# Altium project Dingo_ServoBoard.PrjPcb
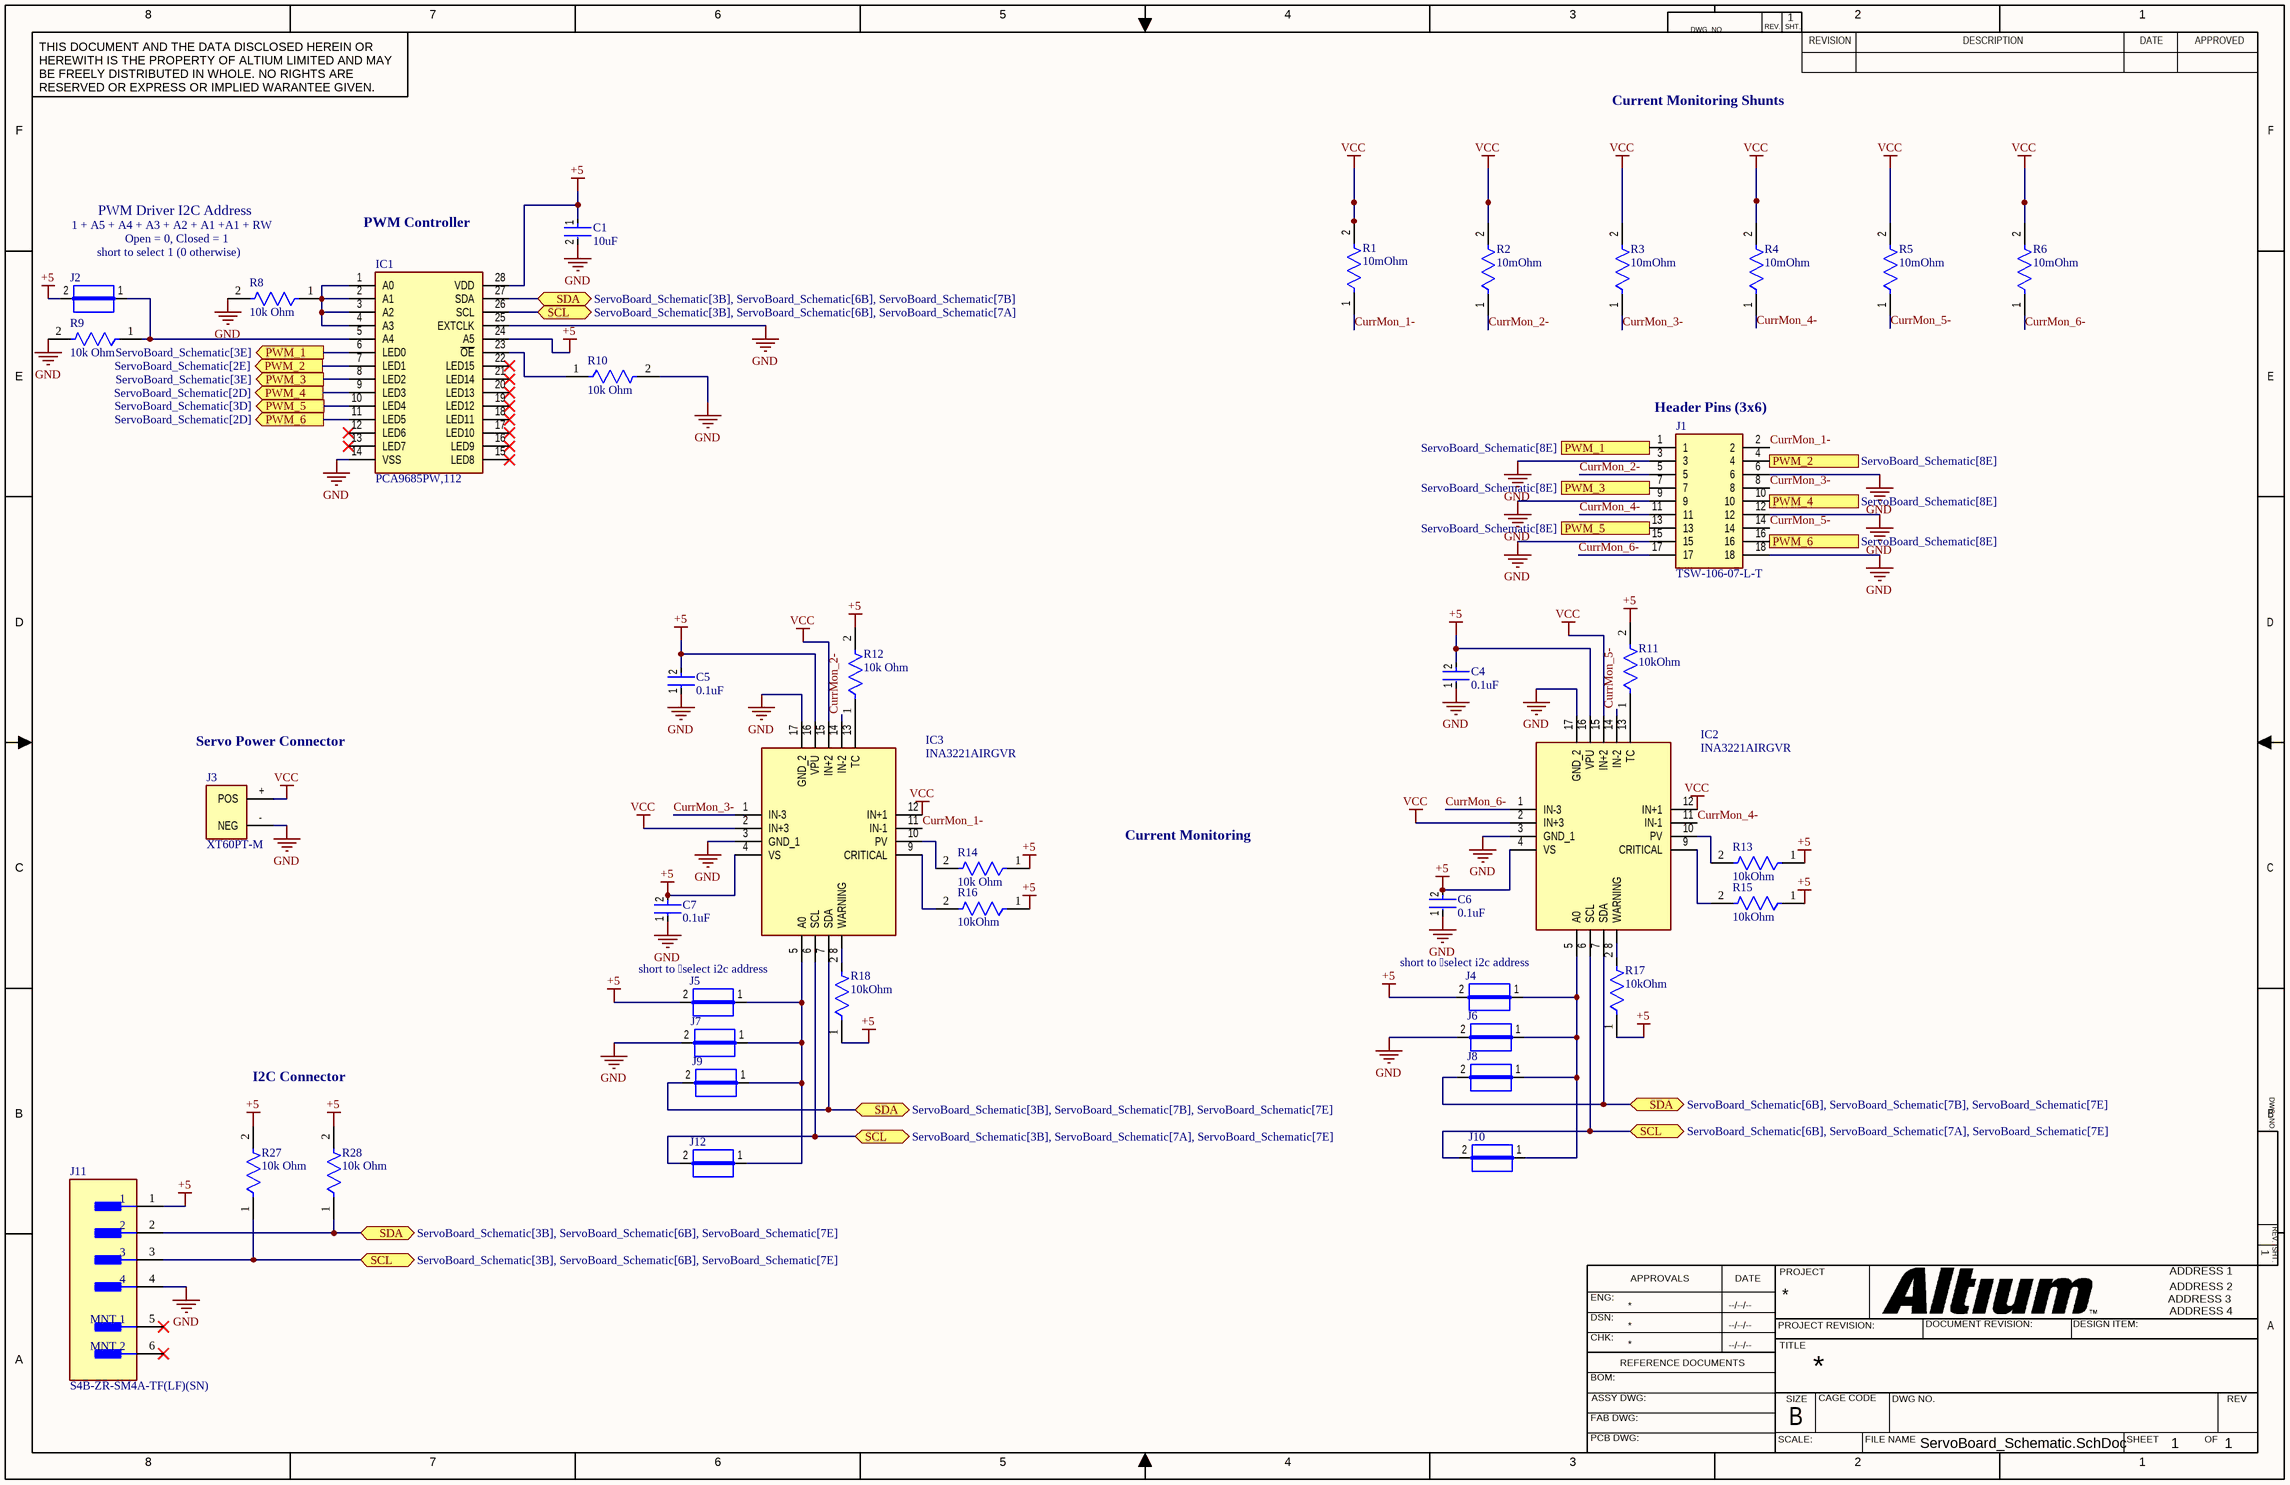
[diagram p0: ServoBoard_Schematic.SchDoc]
1 sheet, 39 parts. Net scope: flat (ports and power ports of the same name join across sheets).
Board file: ServoBoard.PcbDoc

## Sheet ServoBoard_Schematic.SchDoc
size 431 x 279 mm; Organization: ORGANIZATION; Address1: ADDRESS 1; Address2: ADDRESS 2; Address3: ADDRESS 3; Address4: ADDRESS 4; Revision: -; SheetNumber: 1; SheetTotal: 1; ENG_APP_DATE: --/--/--; DSN_APP_DATE: --/--/--; CHK_APP_DATE: --/--/--

### Parts
C1  10uF  [FP-GRM188-0_1-e0_2_0_55-IPC_A]
C4  0.1uF  [FP-GCJ188-0_2-IPC_A]
C5  0.1uF  [FP-GCJ188-0_2-IPC_A]
C6  0.1uF  [FP-GCJ188-0_2-IPC_A]
C7  0.1uF  [FP-GCJ188-0_2-IPC_A]
IC1  PCA9685PW,112  [SOP65P640X110-28N]
IC2  INA3221AIRGVR  [QFN65P400X400X100-17N-D]
IC3  INA3221AIRGVR  [QFN65P400X400X100-17N-D]
J1  TSW-106-07-L-T  [HDRV18W64P254_3X6_1524X749X838P]
J2  JUMPER  [JUMPER]  (value not drawn)
J3  XT60PT-M  [XT60PT-M]
J4  JUMPER  [JUMPER]  (value not drawn)
J5  JUMPER  [JUMPER]  (value not drawn)
J6  JUMPER  [JUMPER]  (value not drawn)
J7  JUMPER  [JUMPER]  (value not drawn)
J8  JUMPER  [JUMPER]  (value not drawn)
J9  JUMPER  [JUMPER]  (value not drawn)
J10  JUMPER  [JUMPER]  (value not drawn)
J11  S4B-ZR-SM4A-TF(LF)(SN)  [FP-S4B-ZR-SM4A-TF_LF_SN-MFG]
J12  JUMPER  [JUMPER]  (value not drawn)
R1  10mOhm  [FP-ERJ8CW-MFG]
R2  10mOhm  [FP-ERJ8CW-MFG]
R3  10mOhm  [FP-ERJ8CW-MFG]
R4  10mOhm  [FP-ERJ8CW-MFG]
R5  10mOhm  [FP-ERJ8CW-MFG]
R6  10mOhm  [FP-ERJ8CW-MFG]
R8  10k Ohm  [FP-ERA3A-IPC_C]
R9  10k Ohm  [FP-ERA3A-IPC_C]
R10  10k Ohm  [FP-ERA3A-IPC_C]
R11  10kOhm  [FP-ERA3A-IPC_C]
R12  10k Ohm  [FP-ERA3A-IPC_C]
R13  10kOhm  [FP-ERA3A-IPC_C]
R14  10k Ohm  [FP-ERA3A-IPC_C]
R15  10kOhm  [FP-ERA3A-IPC_C]
R16  10kOhm  [FP-ERA3A-IPC_C]
R17  10kOhm  [FP-ERA3A-IPC_C]
R18  10kOhm  [FP-ERA3A-IPC_C]
R27  10k Ohm  [FP-ERA3A-IPC_C]
R28  10k Ohm  [FP-ERA3A-IPC_C]

### Ports
PWM_1 (in, see ServoBoard_Schematic[8E]), PWM_1 (out, see ServoBoard_Schematic[3E]), PWM_2 (in, see ServoBoard_Schematic[8E]), PWM_2 (out, see ServoBoard_Schematic[2E]), PWM_3 (in, see ServoBoard_Schematic[8E]), PWM_3 (out, see ServoBoard_Schematic[3E]), PWM_4 (in, see ServoBoard_Schematic[8E]), PWM_4 (out, see ServoBoard_Schematic[2D]), PWM_5 (in, see ServoBoard_Schematic[8E]), PWM_5 (out, see ServoBoard_Schematic[3D]), PWM_6 (in, see ServoBoard_Schematic[8E]), PWM_6 (out, see ServoBoard_Schematic[2D]), SCL (bidir, see ServoBoard_Schematic[3B], ServoBoard_Schematic[6B], ServoBoard_Schematic[7A]), SCL (bidir, see ServoBoard_Schematic[3B], ServoBoard_Schematic[6B], ServoBoard_Schematic[7E]), SCL (bidir, see ServoBoard_Schematic[3B], ServoBoard_Schematic[7A], ServoBoard_Schematic[7E]), SCL (bidir, see ServoBoard_Schematic[6B], ServoBoard_Schematic[7A], ServoBoard_Schematic[7E]), SDA (bidir, see ServoBoard_Schematic[3B], ServoBoard_Schematic[6B], ServoBoard_Schematic[7B]), SDA (bidir, see ServoBoard_Schematic[3B], ServoBoard_Schematic[6B], ServoBoard_Schematic[7E]), SDA (bidir, see ServoBoard_Schematic[3B], ServoBoard_Schematic[7B], ServoBoard_Schematic[7E]), SDA (bidir, see ServoBoard_Schematic[6B], ServoBoard_Schematic[7B], ServoBoard_Schematic[7E])

### Nets
+5: C1.1 C4.2 C5.2 C6.2 C7.2 IC1.24(A5) IC1.28(VDD) IC2.4(VS) IC2.16(VPU) IC3.4(VS) IC3.16(VPU) J2.2 J4.2 J5.2 J11.1 R11.2 R12.2 R13.1 R14.1 R15.1 R16.1 R17.1 R18.1 R27.2 R28.2
GND: C1.2 C4.1 C5.1 C6.1 C7.1 IC1.14(VSS) IC1.25(EXTCLK) IC2.3(GND_1) IC2.17(GND_2) IC3.3(GND_1) IC3.17(GND_2) J1.3 J1.6 J1.9 J1.12 J1.15 J1.18 J3.-(NEG) J6.2 J7.2 J11.4 R8.2 R9.2 R10.2
VCC: IC2.2(IN+3) IC2.12(IN+1) IC2.15(IN+2) IC3.2(IN+3) IC3.12(IN+1) IC3.15(IN+2) J3.+(POS) R1.2 R2.2 R3.2 R4.2 R5.2 R6.2
CurrMon_1-: IC3.11(IN-1) J1.2 R1.1
CurrMon_2-: IC3.14(IN-2) J1.5 R2.1
CurrMon_3-: IC3.1(IN-3) J1.8 R3.1
CurrMon_4-: IC2.11(IN-1) J1.11 R4.1
CurrMon_5-: IC2.14(IN-2) J1.14 R5.1
CurrMon_6-: IC2.1(IN-3) J1.17 R6.1
NetIC1_1: IC1.1(A0) IC1.2(A1) IC1.3(A2) IC1.4(A3) R8.1
NetIC1_5: IC1.5(A4) J2.1 R9.1
NetIC1_6: IC1.6(LED0) J1.1 ; port PWM_1
NetIC1_7: IC1.7(LED1) J1.4 ; port PWM_2
NetIC1_8: IC1.8(LED2) J1.7 ; port PWM_3
NetIC1_9: IC1.9(LED3) J1.10 ; port PWM_4
NetIC1_10: IC1.10(LED4) J1.13 ; port PWM_5
NetIC1_11: IC1.11(LED5) J1.16 ; port PWM_6
NetIC1_23: IC1.23(~{OE}) R10.1
NetIC1_26: IC1.26(SCL) IC2.6(SCL) IC3.6(SCL) J10.2 J11.3 J12.2 R27.1 ; port SCL
NetIC1_27: IC1.27(SDA) IC2.7(SDA) IC3.7(SDA) J8.2 J9.2 J11.2 R28.1 ; port SDA
NetIC2_5: IC2.5(A0) J4.1 J6.1 J8.1 J10.1
NetIC2_8: IC2.8(WARNING) R17.2
NetIC2_9: IC2.9(CRITICAL) R15.2
NetIC2_10: IC2.10(PV) R13.2
NetIC2_13: IC2.13(TC) R11.1
NetIC3_5: IC3.5(A0) J5.1 J7.1 J9.1 J12.1
NetIC3_8: IC3.8(WARNING) R18.2
NetIC3_9: IC3.9(CRITICAL) R16.2
NetIC3_10: IC3.10(PV) R14.2
NetIC3_13: IC3.13(TC) R12.1

Not connected (* = marked no-connect by the designer): IC1 12(LED6)* 13(LED7)* 15(LED8)* 16(LED9)* 17(LED10)* 18(LED11)* 19(LED12)* 20(LED13)* 21(LED14)* 22(LED15)*; J11 5(MNT_1)* 6(MNT_2)*

### Notes on the sheet
- Current Monitoring Shunts
- 1 + A5 + A4 + A3 + A2 + A1 +A1 + RW
- PWM Driver I2C Address
- PWM Controller
- short to select 1 (0 otherwise)
- Open = 0, Closed = 1
- (near J1) Header Pins (3x6)
- (near J3) Servo Power Connector
- Current Monitoring
- short to select i2c address
- I2C Connector
- 8
- 7
- 6
- 5
- 4
- 3
- DWG. NO.
- REV.
- SHT.
- 2
- 1
- THIS DOCUMENT AND THE DATA DISCLOSED HEREIN OR HEREWITH IS THE PROPERTY OF ALTIUM LIMITED AND MAY BE FREELY DISTRIBUTED IN WHOLE. NO RIGHTS ARE RESERVED OR EXPRESS OR IMPLIED WARANTEE GIVEN.
- REVISION
- DESCRIPTION
- DATE
- APPROVED
- F
- E
- D
- C
- B
- ENG:
- APPROVALS
- PROJECT
- A
- DSN:
- CHK:
- REFERENCE DOCUMENTS
- PROJECT REVISION:
- TITLE
- DOCUMENT REVISION:
- DESIGN ITEM:
- BOM:
- FAB DWG:
- PCB DWG:
- ASSY DWG:
- SCALE:
- SIZE
- CAGE CODE
- FILE NAME
- DWG NO.
- SHEET
- OF
- REV

### Library data of the parts
C1 = CMP-2006-02792-2: Chip Multilayer Ceramic Capacitors for General Purpose, 0603, 10uF, X5R, 15%, 20%, 6.3V; Packaging: Tape and Reel; Voltage Rating (DC): 6.3V; Width: 0.031inch; Termination: SMD/SMT; Dielectric: X5R; Package Quantity: 4000; Voltage Rating: 6.3V; Capacitance: 10uF; Case/Package: 0603; Min Operating Temperature: -55°C; Voltage: 6.3V; Length: 1.6mm; Thickness: 0.035inch; Lead Free: Lead Free; Depth: 0.8mm; Case Code (Imperial): 0603; Max Operating Temperature: 85°C; Material: Ceramic; Height: 0.8mm; Tolerance: 20%; Mount: Surface Mount; REACH SVHC: No SVHC; Radiation Hardening: No; Case Code (Metric): 1608
C4-C7 = CMP-06035-047895-1: Cap Ceramic 0.1uF 100V X7R 10% Pad SMD 0603 Soft Termination +125°C Automotive T/R; Capacitance: 100nF; Thickness: 0.035inch; Tolerance: 10%; Packaging: Tape and Reel; Max Operating Temperature: 125°C; Ratings: AEC-Q200; Case/Package: 0603; Length: 0.063inch; Case Code (Imperial): 0603; Min Operating Temperature: -55°C; Width: 0.031inch; Case Code (Metric): 1608; Voltage Rating: 100V; Features: Soft Termination; Mount: Surface Mount; Lead Free: Lead Free
IC1 = PCA9685PW,112: Integrated Circuit; Manufacturer_Name: NXP; Datasheet Link: http://www.nxp.com/docs/en/data-sheet/PCA9685.pdf; Height: 1.1mm; Manufacturer_Part_Number: PCA9685PW,112; Mouser Part Number: 771-PCA9685PW,112; Mouser Price/Stock: https://www.mouser.co.uk/ProductDetail/NXP-Semiconductors/PCA9685PW112?qs=6YAT8rHPFU9wZqiAeiOMZw%3D%3D; Arrow Part Number: PCA9685PW,112; Arrow Price/Stock: https://www.arrow.com/en/products/pca9685pw112/nxp-semiconductors?region=nac
IC2 IC3 = INA3221AIRGVR: Integrated Circuit; Manufacturer_Name: Texas Instruments; Datasheet Link: http://www.ti.com/lit/ds/symlink/ina3221.pdf; Height: 1mm; Manufacturer_Part_Number: INA3221AIRGVR; Mouser Part Number: 595-INA3221AIRGVR; Mouser Price/Stock: https://www.mouser.co.uk/ProductDetail/Texas-Instruments/INA3221AIRGVR?qs=3AcK5DacLboHys8907TVUQ%3D%3D; Arrow Part Number: INA3221AIRGVR; Arrow Price/Stock: https://www.arrow.com/en/products/ina3221airgvr/texas-instruments?region=nac
J1 = TSW-106-07-L-T: Connector; Manufacturer_Name: SAMTEC; Datasheet Link: http://suddendocs.samtec.com/catalog_english/tsw_th.pdf; Height: 8.38mm; Manufacturer_Part_Number: TSW-106-07-L-T; Mouser Part Number: 200-TSW10607LT; Mouser Price/Stock: https://www.mouser.co.uk/ProductDetail/Samtec/TSW-106-07-L-T?qs=rU5fayqh%252BE39iyDwG6o8Cg%3D%3D; Arrow Part Number: TSW-106-07-L-T; Arrow Price/Stock: https://www.arrow.com/en/products/tsw-106-07-l-t/samtec
J2 J4-J10 J12 = CMP-009-00061-2: Pins: 2
J3 = XT60PT-M: Male SMT XT60 Connector
J11 = CMP-17439-000081-1: CONN HEADER SMD R/A 4POS 1.5MM; Gender: Male; Max Current Rating: 1A; Max Voltage Rating (AC): 50V; Number of Contacts: 4; Contact Resistance: 30mR; Pitch: 1.5mm; Depth: 6.5mm; Current Rating: 1A; Packaging: Tape and Reel; Contact Shape: Circular; Voltage Rating: 50V; Insulation Material: Nylon; Color: Natural; Contact Plating: Copper; Width: 3.5mm; Orientation: Right Angle; Length: 9mm; Number of Rows: 1; Lead Free: Lead Free; Insulation Color: Natural; Flammability Rating: UL94 V-0; Housing Color: Beige; Min Operating Temperature: -25°C; Housing Material: Polyamide; Contact Type: Male Pin; Max Operating Temperature: 85°C; Number of Positions: 4; Connector Type: Header; Mount: Surface Mount; Termination: Solder; Max Voltage Rating (DC): 50V; Contact Finish - Mating: TIN; Fastening Type: Detent; Height: 7.2mm; Series: ZH; Contact Material: Brass
R1-R6 = CMP-2003-00786-2: RES 0.01 OHM 1% 1W 1206; Temperature Coefficient: 75ppm/°C; Resistance: 10mR; Military Standard: Not; Depth: 1.6mm; Mount: Surface Mount; Resistor Type: Thick Film; Termination: Flat; Features: Automotive AEC-Q200; Number of Terminations: 2; Max Power Dissipation: 1W; Tolerance: 1%; Case Code (Imperial): 1206; Max Operating Temperature: 125°C; Case Code (Metric): 3216; Lead Free: Lead Free; Case/Package: 1206; Power Rating: 1W; Width: 0.063inch; Packaging: Cut Tape; Length: 3.2mm; Height: 0.03inch; REACH SVHC: No SVHC; Min Operating Temperature: -55°C
R8-R18 R27 R28 = CMP-2000-00874-2: RES SMD 10K OHM 0.1% 1/10W 0603; Voltage Rating (DC): 75V; Power Rating: 100mW; Resistance: 10kR; Temperature Coefficient: 25ppm/°C; Radiation Hardening: No; Width: 0.8mm; Depth: 0.8mm; Construction: Rectangular; Case Code (Metric): 1608; Package Quantity: 5000; Length: 1.6mm; Size Code: 0603; Case Code (Imperial): 0603; Termination: SMD/SMT; Contact Plating: Tin; Resistance Tolerance: 0.1%; Military Standard: Not; Packaging: Tape and Reel; Max Power Dissipation: 100mW; REACH SVHC: No SVHC; Series: ERA-3A; Voltage Rating: 75V; Lead Free: Lead Free; Technology: METAL FILM; RoHS Compliant: Yes; Max Operating Temperature: 155°C; Resistor Type: Thin Film; Min Operating Temperature: -55°C; Number of Pins: 2; Case/Package: 0603; Tolerance: 0.1%; Height: 0.45mm; Mount: Surface Mount; Number of Terminations: 2